# EAGLE design untitled (EAGLE 9.6.2)
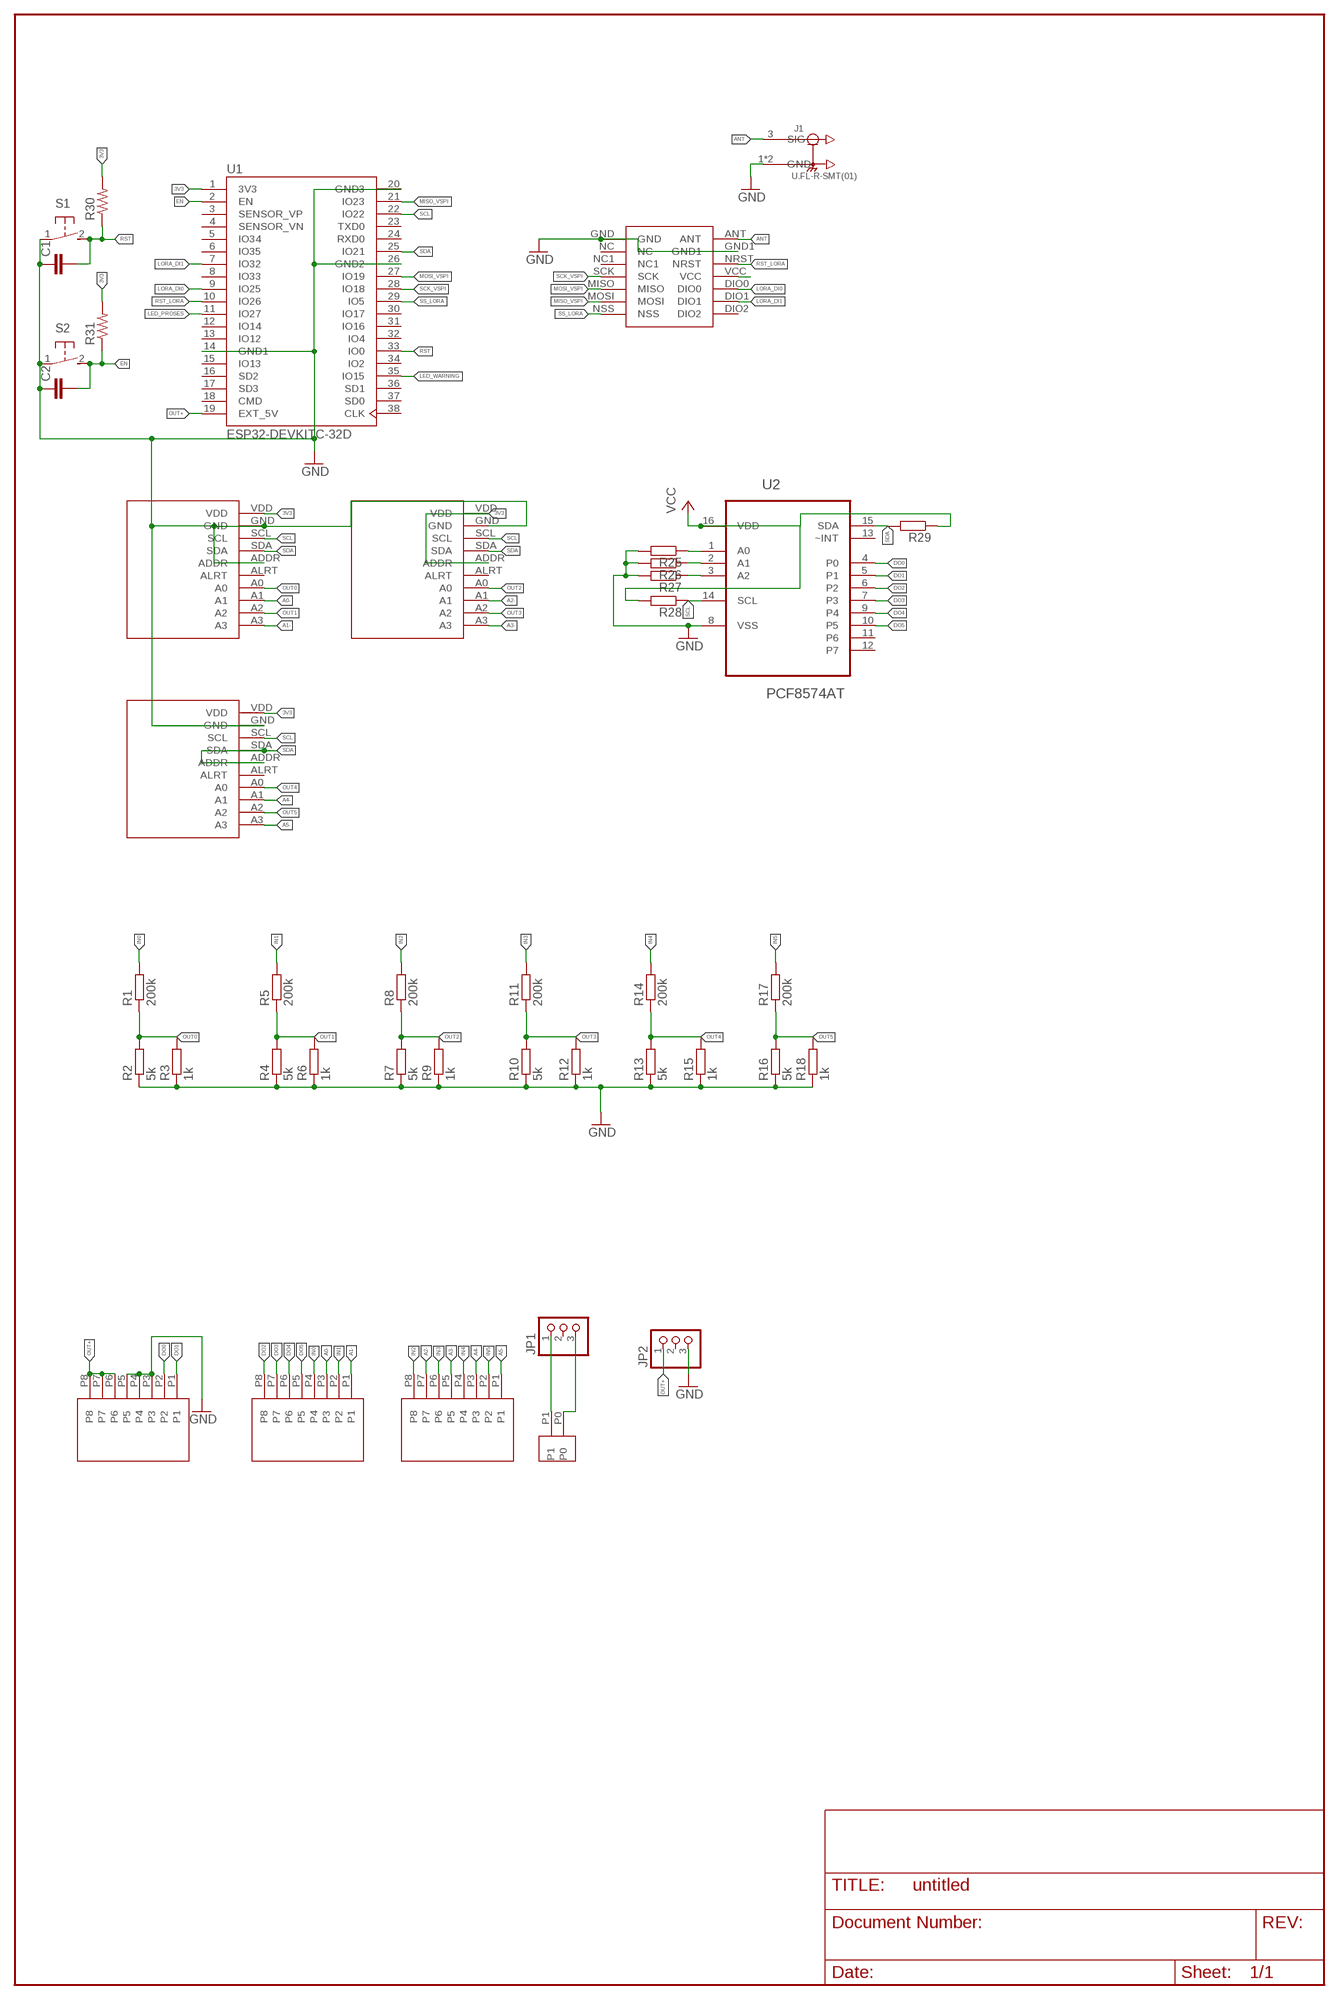
[diagram p0: schematic, sheet 1]

## Parts
ADS1  ADS1115  [ADS1115]
ADS2  ADS1115  [ADS1115]
ADS3  ADS1115  [ADS1115]
C1  C-EUC0805K  [C0805K]
C2  C-EUC0805K  [C0805K]
CONN2P-3.5PI1  CONN2P-3.5PI  [CONN2P-3.5PI]
CONN3.1  CONN3.5  [CONN3.5]
CONN3.2  CONN3.5  [CONN3.5]
CONN3.3  CONN3.5  [CONN3.5]
J1  U.FL-R-SMT(01)  [HRS_U.FL-R-SMT(01)]
JP1  PINHD-1X3  [1X03]
JP2  PINHD-1X3  [1X03]
LORA-NICERF-V1  LORA-NICERF-V2  [LORA-NICERF-V2]
R1  200k  R-EU_R0805  [R0805]
R2  5k  R-EU_R0805  [R0805]
R3  1k  R-EU_R0805  [R0805]
R4  5k  R-EU_R0805  [R0805]
R5  200k  R-EU_R0805  [R0805]
R6  1k  R-EU_R0805  [R0805]
R7  5k  R-EU_R0805  [R0805]
R8  200k  R-EU_R0805  [R0805]
R9  1k  R-EU_R0805  [R0805]
R10  5k  R-EU_R0805  [R0805]
R11  200k  R-EU_R0805  [R0805]
R12  1k  R-EU_R0805  [R0805]
R13  5k  R-EU_R0805  [R0805]
R14  200k  R-EU_R0805  [R0805]
R15  1k  R-EU_R0805  [R0805]
R16  5k  R-EU_R0805  [R0805]
R17  200k  R-EU_R0805  [R0805]
R18  1k  R-EU_R0805  [R0805]
R25  R-EU_R0805  [R0805]
R26  R-EU_R0805  [R0805]
R27  R-EU_R0805  [R0805]
R28  R-EU_R0805  [R0805]
R29  R-EU_R0805  [R0805]
R30  R-US_M0805  [M0805]
R31  R-US_M0805  [M0805]
S1  31-XX  [B3F-31XX]
S2  31-XX  [B3F-31XX]
U1  ESP32-DEVKITC-32D  [MODULE_ESP32-DEVKITC-32D]
U2  PCF8574AT  [SOIC127P1032X265-16N]

## Nets
3V3: ADS1.VDD ADS2.ADDR ADS2.VDD ADS3.VDD R30.2 R31.2 U1.1(3V3)
A0-: ADS1.A1 CONN3.2.P3
A1-: ADS1.A3 CONN3.2.P1
A2-: ADS2.A1 CONN3.3.P7
A3-: ADS2.A3 CONN3.3.P5
A4-: ADS3.A1 CONN3.3.P3
A5-: ADS3.A3 CONN3.3.P1
ANT: J1.3(SIG) LORA-NICERF-V1.ANT
DO0: CONN3.1.P2 U2.4(P0)
DO1: CONN3.1.P1 U2.5(P1)
DO2: CONN3.2.P8 U2.6(P2)
DO3: CONN3.2.P7 U2.7(P3)
DO4: CONN3.2.P6 U2.9(P4)
DO5: CONN3.2.P5 U2.10(P5)
EN: C2.2 R31.1 S2.2(S) U1.2(EN)
GND: ADS1.ADDR ADS1.GND ADS2.GND ADS3.GND C1.1 C2.1 CONN3.1.P3 CONN3.1.P4 CONN3.1.P5 J1.1(GND) J1.2(GND) JP2.3 LORA-NICERF-V1.GND LORA-NICERF-V1.GND1 R2.1 R3.1 R4.1 R6.1 R7.1 R9.1 R10.1 R12.1 R13.1 R15.1 R16.1 R18.1 R25.2 R26.2 R27.2 S1.1(P) S2.1(P) U1.14(GND1) U1.20(GND3) U1.26(GND2) U2.8(VSS)
IN0: CONN3.2.P4 R1.2
IN1: CONN3.2.P2 R5.2
IN2: CONN3.3.P8 R8.2
IN3: CONN3.3.P6 R11.2
IN4: CONN3.3.P4 R14.2
IN5: CONN3.3.P2 R17.2
LED_PROSES: U1.11(IO27)
LED_WARNING: U1.35(IO15)
LORA_DI0: LORA-NICERF-V1.DIO0 U1.9(IO25)
LORA_DI1: LORA-NICERF-V1.DIO1 U1.7(IO32)
MISO_VSPI: LORA-NICERF-V1.MOSI U1.21(IO23)
MOSI_VSPI: LORA-NICERF-V1.MISO U1.27(IO19)
N$1: R25.1 U2.1(A0)
N$2: R26.1 U2.2(A1)
N$3: R27.1 U2.3(A2)
N$4: CONN2P-3.5PI1.P1 JP1.1
N$5: CONN2P-3.5PI1.P0 JP1.3
N$26: LORA-NICERF-V1.VCC
OUT0: ADS1.A0 R1.1 R2.2 R3.2
OUT1: ADS1.A2 R4.2 R5.1 R6.2
OUT2: ADS2.A0 R7.2 R8.1 R9.2
OUT3: ADS2.A2 R10.2 R11.1 R12.2
OUT4: ADS3.A0 R13.2 R14.1 R15.2
OUT5: ADS3.A2 R16.2 R17.1 R18.2
OUT+: CONN3.1.P6 CONN3.1.P7 CONN3.1.P8 JP2.1 U1.19(EXT_5V)
RST: C1.2 R30.1 S1.2(S) U1.33(IO0)
RST_LORA: LORA-NICERF-V1.NRST U1.10(IO26)
SCK_VSPI: LORA-NICERF-V1.SCK U1.28(IO18)
SCL: ADS1.SCL ADS2.SCL ADS3.SCL R28.1 U1.22(IO22) U2.14(SCL)
SDA: ADS1.SDA ADS2.SDA ADS3.ADDR ADS3.SDA R29.2 U1.25(IO21) U2.15(SDA)
SS_LORA: LORA-NICERF-V1.NSS U1.29(IO5)
VCC: R28.2 R29.1 U2.16(VDD)
Unconnected: ADS1.ALRT ADS2.ALRT ADS3.ALRT JP1.2 JP2.2 LORA-NICERF-V1.DIO2 LORA-NICERF-V1.NC LORA-NICERF-V1.NC1 U1.3(SENSOR_VP) U1.4(SENSOR_VN) U1.5(IO34) U1.6(IO35) U1.8(IO33) U1.12(IO14) U1.13(IO12) U1.15(IO13) U1.16(SD2) U1.17(SD3) U1.18(CMD) U1.23(TXD0) U1.24(RXD0) U1.30(IO17) U1.31(IO16) U1.32(IO4) U1.34(IO2) U1.36(SD1) U1.37(SD0) U1.38(CLK) U2.11(P6) U2.12(P7) U2.13(~INT)

## Library data of the parts
ADS1-ADS3 = ds1115:ADS1115
C1 C2 = rcl:C-EU: CAPACITOR, European symbol; SPICEPREFIX: C
CONN2P-3.5PI1 = CONN2P-3.5PI:CONN2P-3.5PI
CONN3.1-CONN3.3 = CONN3.5:CONN3.5
J1 = U.FL-R-SMT_01_:U.FL-R-SMT(01): U.FL Series 6 Ghz 50 Ohm Ultra-small SMT Coaxial Cable Receptacle Check availability <https://pricing.snapeda.com/parts/U.FL-R-SMT%2801%29/Hirose/view-part?ref=eda>; AVAILABILITY: In Stock; DESCRIPTION: U.FL (UMCC) Connector Receptacle, Male Pin 50Ohm Surface Mount Solder. RF Connectors / Coaxial Connectors; MF: Hirose; MP: U.FL-R-SMT(01); PACKAGE: None; PRICE: None; PURCHASE-URL: https://pricing.snapeda.com/search/part/U.FL-R-SMT(01)/?ref=eda
JP1 JP2 = pinhead:PINHD-1X3: PIN HEADER
LORA-NICERF-V1 = LORA-NICERF-V2:LORA-NICERF-V2
R1-R18 R25-R29 = rcl:R-EU_: RESISTOR, European symbol; SPICEPREFIX: R
R30 R31 = adafruit:R-US_: RESISTOR, American symbol
S1 S2 = switch-omron:31-XX: OMRON SWITCH; MPN: B3F-3100; OC_FARNELL: 959704; OC_NEWARK: 36M3582
U1 = ESP32-DEVKITC-32D:ESP32-DEVKITC-32D: Eval Board For Esp-Wroom-32 Check availability <https://pricing.snapeda.com/parts/ESP32-DEVKITC-32D/Espressif%20Systems/view-part?ref=eda>; AVAILABILITY: In Stock; DESCRIPTION: WiFi Development Tools (802.11) ESP32 General Development Kit, ESP32-WROOM-32D on the board; MF: Espressif Systems; MP: ESP32-DEVKITC-32D; PACKAGE: None; PRICE: None; PURCHASE-URL: https://pricing.snapeda.com/search/part/ESP32-DEVKITC-32D/?ref=eda
U2 = PCF8574AT:PCF8574AT: Remote 8-bit I/O expander for I2C-bus Check availability <https://pricing.snapeda.com/parts/PCF8574AT/NXP%20USA/view-part?ref=eda>; AVAILABILITY: In Stock; DESCRIPTION: I²C Bus IC Operating temperature: -40...+85 °C Power supply: 2.5...6 V Package: SO-16W; MF: NXP USA; MP: PCF8574AT; PACKAGE: SOIC-16 NXP USA; PRICE: None; PURCHASE-URL: https://pricing.snapeda.com/search/part/PCF8574AT/?ref=eda

## Board
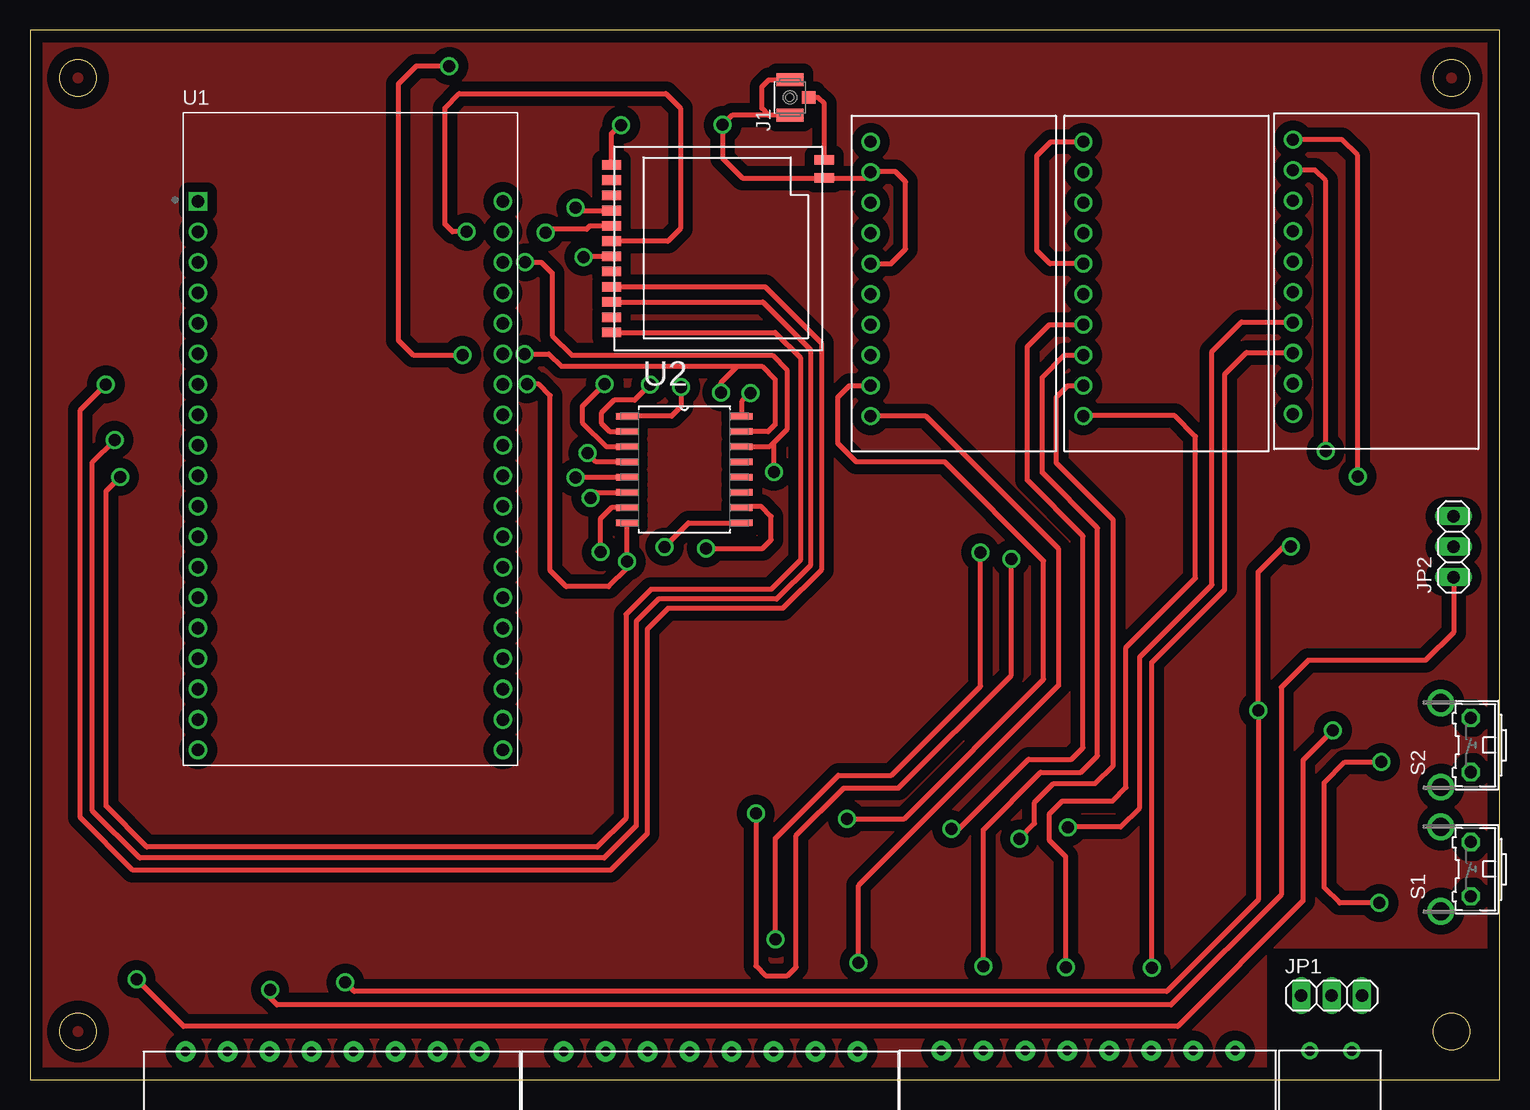
[diagram p1: board, top side]
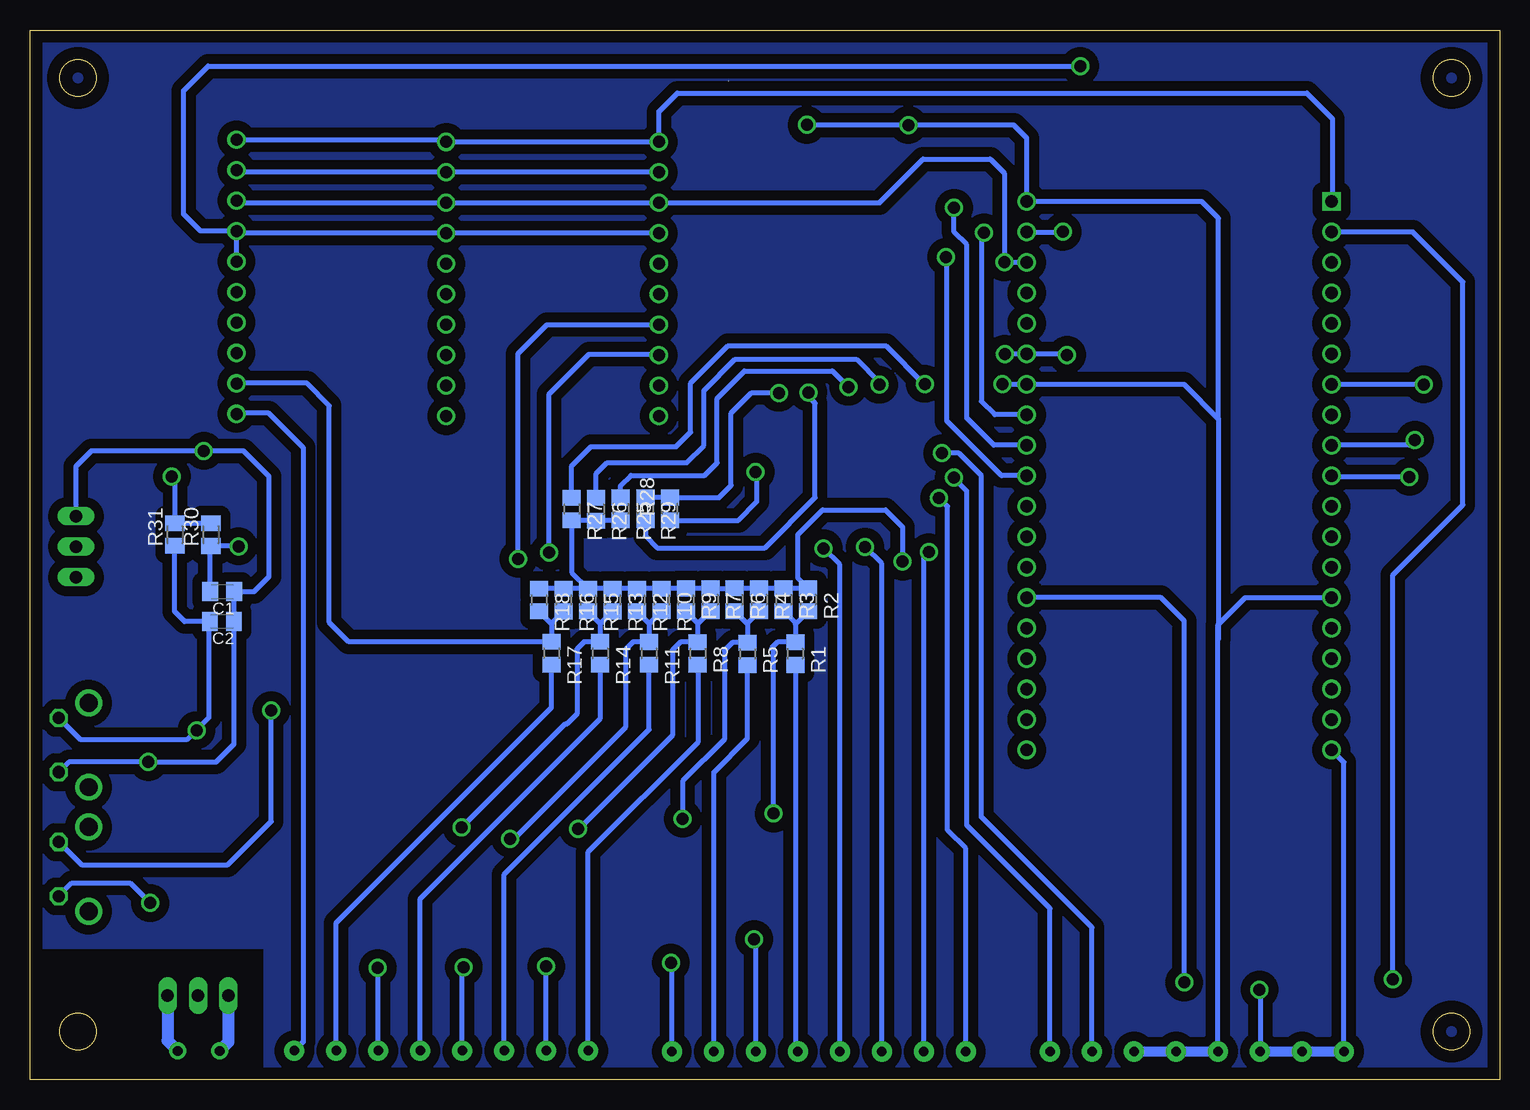
[diagram p2: board, bottom side, seen from below]

Size 122.5 x 87.5 mm. Coordinates in mm from the lower left corner, seen from the top.
Outline: 0,0 122.5,0 122.5,87.5 0,87.5 0,0
Outline: circle at 118.5,83.5 radius 1.5
Outline: circle at 118.5,4 radius 1.5
Outline: circle at 4,4 radius 1.5
Outline: circle at 4,83.5 radius 1.5
Copper layers (1*16): Top 0.035mm / dielectric 1.5mm / Bottom 0.035mm
Design rules "default": minimum track width 6mil, minimum drill 0.35mm, track to track 6mil, track to pad 6mil, pad to pad 6mil, via to via 6mil, smd to smd 6mil, copper to edge 40mil, drill to drill 6mil, minimum pad ring 10mil, minimum via ring 8mil, stop-mask expansion 4mil, vias tented up to drill 0mil, thermal gap 10mil

### Footprints (pad centres in the part's own frame; a part is rotated, then mirrored left to right if it is on the bottom)
ADS1115 = drill 1: A0 -6.35,-1.27; A1 -6.35,-3.81; A2 -6.35,-6.35; A3 -6.35,-8.89; ADDR -6.35,3.81; ALRT -6.35,1.27; GND -6.35,11.43; SCL -6.35,8.89; SDA -6.35,6.35; VDD -6.35,13.97
C0805K = smd 1.3 x 1.6: 1 -1,0; 2 1,0
CONN2P-3.5PI = drill 0.8 pad 1.422: P0 2.421,0.016; P1 5.921,0.016
CONN3.5 = drill 0.8 pad 1.676: P1 -28,0; P2 -24.5,0; P3 -21,0; P4 -17.5,0; P5 -14,0; P6 -10.5,0; P7 -7,0; P8 -3.5,0
HRS_U.FL-R-SMT(01) = smd 1.1 x 2.25: 1 -1.475,0; 2 1.475,0 | smd 1.05 x 1.1: 3 0,-1.55
1X03 = drill 1.016 long: 1 -2.54,0; 2 0,0; 3 2.54,0
LORA-NICERF-V2 = smd 1.6 x 0.8: ANT 9.17,6.81; DIO0 -8.57,-5.03; DIO1 -8.57,-3.76; DIO2 -8.57,-2.49; GND -8.57,6.4; GND1 9.17,5.31; MISO -8.57,1.32; MOSI -8.57,0.05; NC -8.57,5.13; NC1 -8.57,3.86; NRST -8.57,-7.57; NSS -8.57,-1.22; SCK -8.57,2.59; VCC -8.57,-6.3
R0805 = smd 1.3 x 1.5: 1 -0.95,0; 2 0.95,0
M0805 = smd 1.3 x 1.6: 1 -0.95,0; 2 0.95,0
B3F-31XX = drill 1.016 octagon: 1 -2.261,-1.245; 2 2.261,-1.245 | drill 1.499 pad 2.159: 3 -3.505,1.245; 4 3.505,1.245
MODULE_ESP32-DEVKITC-32D = drill 1.04 square: 1 -12.7,19.76 | drill 1.04: 2 -12.7,17.22; 3 -12.7,14.68; 4 -12.7,12.14; 5 -12.7,9.6; 6 -12.7,7.06; 7 -12.7,4.52; 8 -12.7,1.98; 9 -12.7,-0.56; 10 -12.7,-3.1; 11 -12.7,-5.64; 12 -12.7,-8.18; 13 -12.7,-10.72; 14 -12.7,-13.26; 15 -12.7,-15.8; 16 -12.7,-18.34; 17 -12.7,-20.88; 18 -12.7,-23.42; 19 -12.7,-25.96; 20 12.7,19.76; 21 12.7,17.22; 22 12.7,14.68; 23 12.7,12.14; 24 12.7,9.6; 25 12.7,7.06; 26 12.7,4.52; 27 12.7,1.98; 28 12.7,-0.56; 29 12.7,-3.1; 30 12.7,-5.64; 31 12.7,-8.18; 32 12.7,-10.72; 33 12.7,-13.26; 34 12.7,-15.8; 35 12.7,-18.34; 36 12.7,-20.88; 37 12.7,-23.42; 38 12.7,-25.96
SOIC127P1032X265-16N = smd 1.803 x 0.533: 1 -4.775,4.445; 2 -4.775,3.175; 3 -4.775,1.905; 4 -4.775,0.635; 5 -4.775,-0.635; 6 -4.775,-1.905; 7 -4.775,-3.175; 8 -4.775,-4.445; 9 4.775,-4.445; 10 4.775,-3.175; 11 4.775,-1.905; 12 4.775,-0.635; 13 4.775,0.635; 14 4.775,1.905; 15 4.775,3.175; 16 4.775,4.445

### Placement (x,y rotation side)
ADS1  76.43,64.2 0 top
ADS2  94.15,64.2 0 top
ADS3  111.64,64.39 0 top
C1  106.48,40.68 180 bottom
C2  106.5,38.19 180 bottom
CONN2P-3.5PI1  112.61,2.4 180 top
CONN3.1  9.47,2.33 180 top
CONN3.2  40.99,2.33 180 top
CONN3.3  72.47,2.4 180 top
J1  63.36,81.87 90 top
JP1  108.5,7 0 top
JP2  118.67,44.42 90 top
LORA-NICERF-V1  57.04,69.85 0 top
R1  58.7,35.51 270 bottom
R2  57.63,40 270 bottom
R3  59.67,40 270 bottom
R4  61.71,40 270 bottom
R5  62.69,35.48 270 bottom
R6  63.75,40 270 bottom
R7  65.79,39.99 270 bottom
R8  66.84,35.52 270 bottom
R9  67.82,39.99 270 bottom
R10  69.86,39.98 270 bottom
R11  70.89,35.53 270 bottom
R12  71.89,39.98 270 bottom
R13  73.94,39.97 270 bottom
R14  74.97,35.54 270 bottom
R15  75.98,39.98 270 bottom
R16  78.01,39.97 270 bottom
R17  79.03,35.55 270 bottom
R18  80.06,39.98 270 bottom
R25  73.25,47.57 270 bottom
R26  75.3,47.55 270 bottom
R27  77.34,47.56 270 bottom
R28  69.16,47.57 90 bottom
R29  71.21,47.58 270 bottom
R30  107.41,45.43 90 bottom
R31  110.41,45.43 90 bottom
S1  118.86,17.54 90 top
S2  118.86,27.88 90 top
U1  26.71,53.44 0 top
U2  54.55,50.85 0 top

### Tracks (layer width: path | path; a pad name or v marks a point on that pad's centre or on a via)
3V3  (via drill 1)
  Top 0.406: ADS2.ADDR 85.04,68.01 83.93,69.12 83.93,77.02 85.09,78.18 ADS2.VDD | v110.68,50.28 110.68,77.04 109.35,78.37 105.3,78.37 ADS3.VDD
  Bottom 0.406: ADS3.VDD 87.99,78.36 ADS2.VDD ADS1.VDD 70.08,80.69 68.54,82.23 16.06,82.23 13.93,80.1 13.93,73.28 U1.1 | R30.2 R31.2 110.41,50.01 v110.68,50.28
A0-  (via drill 1)
  Top 0.406: v62.14,11.69 62.14,20.11 67.38,25.36 71.8,25.36 79.23,32.78 79.23,43.92 v79.21,43.94
  Bottom 0.406: CONN3.2.P3 61.99,11.5 62.16,11.67 v62.14,11.69 | v79.21,43.94 79.21,57.16 75.9,60.47 70.16,60.47 ADS1.A1
A1-  (via drill 1)
  Top 0.406: v69.07,9.73 69.07,16.18 85.77,32.88 85.77,44.22 74.68,55.31 ADS1.A3
  Bottom 0.406: CONN3.2.P1 68.99,9.65 v69.07,9.73
A2-  (via drill 1)
  Top 0.406: v79.46,9.43 79.46,20.83 84.24,25.61 87.61,25.61 88.99,26.98 88.99,45.98 84.38,50.59 84.38,58.54 86.23,60.39 ADS2.A1
  Bottom 0.406: CONN3.3.P7 v79.47,9.42 v79.46,9.43
A3-  (via drill 1)
  Top 0.406: v86.35,9.36 86.35,18.57 84.98,19.93 84.98,22.15 86.05,23.22 90.27,23.22 91.37,24.33 91.37,36.03 97.15,41.8 97.15,53.61 95.42,55.34 87.83,55.34 ADS2.A3
  Bottom 0.406: CONN3.3.P5 86.47,9.23 v86.35,9.36
A4-  (via drill 1)
  Top 0.406: v93.52,9.31 93.52,34.77 99.6,40.85 99.6,58.8 101.42,60.61 105.26,60.61 ADS3.A1
  Bottom 0.406: CONN3.3.P3 93.47,9.26 v93.52,9.31
A5-
  Bottom 0.406: CONN3.3.P1 99.72,3.15 99.72,52.68 102.6,55.56 105.23,55.56 ADS3.A3
ANT
  Top 0.406: LORA-NICERF-V1.ANT 66.21,81.37 65.71,81.87 J1.3
DO0  (via drill 1)
  Top 0.406: U2.4 47.2,51.48 v46.48,52.21
  Bottom 0.406: CONN3.1.P2 33.97,12.68 43.19,21.9 43.19,50.34 45.06,52.21 v46.48,52.21
DO1  (via drill 1)
  Top 0.406: v45.5,50.17 45.54,50.22 U2.5
  Bottom 0.406: CONN3.1.P1 37.47,14.27 44.41,21.21 44.41,49.08 v45.5,50.17
DO2  (via drill 1)
  Top 0.406: v46.72,48.5 47.16,48.95 U2.6
  Bottom 0.406: CONN3.2.P8 44.49,19.27 46,20.78 46,47.78 v46.72,48.5
DO3  (via drill 1)
  Top 0.406: v47.56,43.98 47.56,46.78 48.2,47.41 48.38,47.6 48.46,47.67 U2.7
  Bottom 0.406: CONN3.2.P7 47.99,43.55 v47.56,43.98
DO4  (via drill 1)
  Top 0.406: v52.9,44.41 54.89,46.41 U2.9
  Bottom 0.406: CONN3.2.P6 51.49,43.01 v52.9,44.41
DO5  (via drill 1)
  Top 0.406: v56.34,44.28 61.08,44.28 61.79,44.98 61.79,46.96 60.99,47.76 59.41,47.76 U2.10
  Bottom 0.406: CONN3.2.P5 54.99,42.93 v56.34,44.28 | v56.34,44.28
EN  (via drill 1)
  Top 0.406: v108.62,29.12 106.12,26.62 106.12,14.88 95.67,4.43 12.81,4.43 v8.88,8.36
  Bottom 0.406: C2.2 107.67,38.19 | 107.67,38.19 109.61,38.19 110.45,39.02 110.45,44.44 R31.1 | S2.2 118.33,28.37 109.38,28.37 v108.62,29.12 107.56,30.18 107.56,38.08 107.67,38.19 | v8.88,8.36 8.88,42.08 3.05,47.91 3.05,66.49 7.21,70.66 U1.2
GND  (via drill 1)
  Top 0.406: J1.1 61.57,80.39 | 61.57,80.39 61.01,80.96 61.01,82.76 61.59,83.34 J1.2 | LORA-NICERF-V1.GND 48.47,78.86 49.23,79.62 | 49.23,79.62 | 49.23,79.62 v49.27,79.57 | 61.57,80.39 58.54,80.39 v57.74,79.59 57.74,76.82 59.39,75.16 LORA-NICERF-V1.GND1 69.61,75.16 ADS1.GND 70.15,75.7 72.14,75.7 73,74.84 73,69.23 71.78,68.01 ADS1.ADDR | v112.48,14.71 109.17,14.71 107.89,15.99 107.89,24.75 109.61,26.47 v112.63,26.47 | U2.8 49.75,46.38 v49.75,43.17 49.75,42.6 48.24,41.09 44.69,41.09 43.36,42.42 43.36,57.04 42.42,57.98 v41.42,57.98 | v108.01,52.41 108.01,74.93 107.11,75.82 ADS3.GND
  Bottom 0.406: CONN3.1.P5 23.47,36.7 | 23.47,36.7 23.47,37.9 21.19,40.18 U1.14 | 23.43,55.08 26.3,57.96 U1.26 39.43,57.98 v41.42,57.98 | 23.43,55.08 23.43,36.75 23.47,36.7 | 23.43,55.08 23.43,71.81 24.82,73.2 U1.20 39.41,78.5 40.48,79.57 v49.27,79.57 57.72,79.57 v57.74,79.59 | R6.1 R4.1 61.7,40.95 R3.1 R2.1 58.5,41.82 58.5,45.42 56.42,47.49 51.19,47.49 49.75,46.06 v49.75,43.17 | R6.1 | R6.1 R7.1 R9.1 69.85,40.94 R10.1 R12.1 | R12.1 | R12.1 R13.1 R15.1 | R15.1 R16.1 R18.1 | ADS1.GND ADS2.GND 105.1,75.63 ADS3.GND | JP2.3 118.67,51.12 117.39,52.41 v108.01,52.41 104.69,52.41 102.57,50.28 102.57,41.93 103.83,40.68 C1.1 105.5,40.66 C2.1 105.49,27.96 106.98,26.47 v112.63,26.47 119.25,26.47 S2.1 | S1.1 119,16.38 114.15,16.38 v112.48,14.71 | R25.2 75.27,46.62 R26.2 77.33,46.6 R27.2 77.34,42.28 R15.1
  Bottom 0.813: CONN3.1.P5 CONN3.1.P4 CONN3.1.P3
IN0
  Bottom 0.406: R1.2 58.7,2.54 CONN3.2.P4
IN1
  Bottom 0.406: CONN3.2.P2 65.49,25.62 62.69,28.42 R5.2
IN2
  Bottom 0.406: CONN3.3.P8 75.97,18.98 66.78,28.16 66.78,33.92 66.86,34 66.86,34.55 R8.2
IN3
  Bottom 0.406: CONN3.3.P6 82.97,17.1 70.89,29.18 R11.2
IN4
  Bottom 0.406: CONN3.3.P4 89.97,15.08 74.94,30.11 74.94,34.56 R14.2
IN5
  Bottom 0.406: CONN3.3.P2 96.97,13.06 86.5,23.53 79.03,31.01 R17.2
LORA_DI0  (via drill 1)
  Top 0.406: LORA-NICERF-V1.DIO0 61.09,64.82 65.04,60.87 65.04,42.85 62.24,40.05 52.39,40.05 50.54,38.2 50.54,21.13 47.87,18.46 9.15,18.46 5.2,22.41 5.2,51.47 v7.06,53.33
  Bottom 0.406: v7.06,53.33 7.51,52.88 U1.9
LORA_DI1  (via drill 1)
  Top 0.406: LORA-NICERF-V1.DIO1 61.29,66.09 65.97,61.41 65.97,42.5 62.75,39.28 53.19,39.28 51.44,37.53 51.44,20.49 48.41,17.46 8.57,17.46 4.19,21.84 4.19,55.81 v6.33,57.95
  Bottom 0.406: v6.33,57.95 U1.7
MISO_VSPI  (via drill 1)
  Top 0.406: v36.41,70.67 35.22,70.67 34.59,71.3 34.59,80.99 35.78,82.19 53,82.19 54.22,80.97 54.22,70.94 53.17,69.89 LORA-NICERF-V1.MOSI
  Bottom 0.406: U1.21 36.45,70.66 36.43,70.68 v36.41,70.67
MOSI_VSPI  (via drill 1)
  Top 0.406: v42.97,70.62 43.24,70.89 46.41,70.89 46.69,71.17 LORA-NICERF-V1.MISO
  Bottom 0.406: U1.27 42.07,55.42 43.19,56.54 43.19,70.4 v42.97,70.62
N$1  (via drill 1)
  Top 0.406: v54.29,57.74 54.29,56.09 53.49,55.3 U2.1
  Bottom 0.406: R25.1 73.25,49.53 72.41,50.37 66.25,50.37 65.22,51.4 65.22,56.79 62.94,59.07 55.62,59.07 v54.29,57.74
N$2  (via drill 1)
  Top 0.406: v51.7,57.92 50.41,56.63 48.69,56.63 47.62,55.56 47.62,54.73 48.33,54.02 U2.2
  Bottom 0.406: R26.1 75.3,50.51 74.39,51.42 67.77,51.42 66.33,52.86 66.33,57.43 63.71,60.05 53.62,60.05 51.7,58.12 v51.7,57.92
N$3  (via drill 1)
  Top 0.406: v47.91,57.99 46.04,56.12 46.04,54.78 48.07,52.76 U2.3
  Bottom 0.406: R27.1 77.34,51.16 75.75,52.76 68.64,52.76 67.43,53.97 67.43,58.05 64.3,61.18 51.16,61.18 47.98,57.99 v47.91,57.99
N$4
  Bottom 1.016: JP1.1 105.96,3.11 CONN2P-3.5PI1.P1
N$5
  Bottom 1.016: JP1.3 111.04,3.23 CONN2P-3.5PI1.P0
N$6
  pour Top (isolate 0.813): 0,87.5 122.5,87.5 122.5,11 103,11 103,0 0,0
N$7
  pour Bottom (isolate 0.813): 0,87.5 122.5,87.5 122.5,11 103,11 103,0 0,0
OUT0  (via drill 1)
  Top 0.406: v60.5,22.18 60.5,9.47 61.32,8.65 63.14,8.65 63.86,9.37 63.86,20.33 67.84,24.31 72.41,24.31 81.8,33.7 v81.8,43.41
  Bottom 0.406: R2.2 58.7,37.98 R1.1 | R3.2 58.7,38.09 R1.1 | R1.1 60.17,36.46 60.67,35.96 60.58,35.87 60.58,22.26 v60.5,22.18 | v81.8,43.41 81.8,60.53 79.4,62.93 ADS1.A0
OUT1  (via drill 1)
  Top 0.406: v68.09,21.75 72.89,21.75 84.5,33.36 84.5,43.24 76.26,51.48 68.89,51.48 67.34,53.03 67.34,56.89 68.3,57.85 ADS1.A2
  Bottom 0.406: R4.2 62.69,38.06 R5.1 | R6.2 62.69,37.99 R5.1 | R5.1 63.94,36.43 64.61,35.76 64.61,28.36 68.09,24.89 v68.09,21.75
OUT2  (via drill 1)
  Top 0.406: v76.81,20.89 77.44,20.89 83.24,26.7 86.83,26.7 87.79,27.66 87.79,45.3 83.13,49.96 83.13,61.1 84.97,62.93 ADS2.A0
  Bottom 0.406: R7.2 66.84,37.99 R8.1 | R9.2 66.84,38.05 R8.1 | R8.1 68.28,36.47 68.94,35.81 68.94,28.69 76.74,20.89 v76.81,20.89
OUT3  (via drill 1)
  Top 0.406: v82.46,20.07 83.74,21.35 83.74,23.09 85.32,24.67 88.79,24.67 90.3,26.19 90.3,46.66 85.56,51.41 85.56,56.89 86.52,57.85 ADS2.A2
  Bottom 0.406: R10.2 70.89,38 R11.1 | R12.2 70.89,38.02 R11.1 | R11.1 72.21,36.48 72.86,35.84 72.86,29.36 82.15,20.07 v82.46,20.07
OUT4  (via drill 1)
  Top 0.406: v86.5,21.02 86.54,21.06 90.91,21.06 92.51,22.66 92.51,35.21 98.54,41.24 98.54,60.69 101,63.15 105.26,63.15 ADS3.A0
  Bottom 0.406: R13.2 74.97,38 R14.1 | R15.2 74.97,38.01 R14.1 | R14.1 76.32,36.49 76.91,35.9 76.91,30.47 77.74,29.64 77.88,29.64 v86.5,21.02
OUT5
  Bottom 0.406: R16.2 79.03,38.01 R17.1 | R18.2 79.03,37.99 R17.1 | R17.1 95.93,36.5 97.55,38.12 97.55,56.18 99.41,58.05 ADS3.A2
OUT+  (via drill 1)
  Top 0.406: JP2.1 118.67,37.29 116.33,34.95 106.55,34.95 104.3,32.69 104.3,15.4 95.12,6.22 20.59,6.22 20,6.81 v20,7.48
  Bottom 0.406: CONN3.1.P8 12.97,26.44 U1.19 | v20,7.48 19.95,7.43 19.95,2.35 CONN3.1.P6
  Bottom 0.813: CONN3.1.P8 CONN3.1.P7 CONN3.1.P6
RST  (via drill 1)
  Top 0.406: v105.11,44.45 105.11,44.48 105.09,44.5 104.55,44.5 102.38,42.33 v102.38,30.79 102.38,14.96 94.77,7.35 27.03,7.35 v26.28,8.1
  Bottom 0.406: C1.2 107.48,44.41 R30.1 105.14,44.48 v105.11,44.45 | S1.2 118.2,17.9 106,17.9 102.38,21.52 v102.38,30.79 | v26.28,8.1 26.28,38.24 28.22,40.18 U1.33
RST_LORA  (via drill 1)
  Top 0.406: LORA-NICERF-V1.NRST 62.12,62.28 64.22,60.18 64.22,43.29 61.79,40.86 51.75,40.86 49.67,38.78 49.67,21.79 47.28,19.39 9.74,19.39 6.34,22.8 6.34,49.06 v7.51,50.23
  Bottom 0.406: v7.51,50.23 13.9,50.23 U1.10
SCK_VSPI  (via drill 1)
  Top 0.406: v45.46,72.68 45.71,72.44 LORA-NICERF-V1.SCK
  Bottom 0.406: U1.28 42.16,52.88 44.41,55.13 44.41,69.59 45.46,70.65 v45.46,72.68
SCL  (via drill 1)
  Top 0.406: v41.28,68.14 42.62,68.14 43.52,67.23 43.52,62.02 45.17,60.38 61.88,60.38 63.09,59.16 63.09,54.2 62.01,53.12 | 62.01,53.12 61.64,52.75 U2.14 | v62.01,50.65 62.01,53.12
  Bottom 0.406: U1.22 40.98,68.12 40.99,68.14 v41.28,68.14 41.28,75.56 42.45,76.73 48.04,76.73 51.68,73.09 ADS1.SCL ADS2.SCL 105.1,73.09 ADS3.SCL | R28.1 63.45,46.62 61.9,48.17 61.9,50.65 v62.01,50.65
SDA  (via drill 1)
  Top 0.406: v41.24,60.49 43.27,60.49 44.3,59.46 58.98,59.46 | 58.98,59.46 61.01,59.46 62.1,58.37 62.1,54.6 61.52,54.02 U2.15 | v34.96,84.5 32.21,84.5 30.7,82.99 30.7,61.64 31.94,60.4 v36.05,60.4 v36.06,60.4 | v57.61,57.29 57.61,58.09 58.98,59.46
  Bottom 0.406: v41.24,60.49 41.22,60.51 41.22,60.5 U1.25 36.16,60.5 v36.06,60.4 | ADS1.SDA ADS2.SDA 105.1,70.55 | 105.1,70.55 ADS3.SDA 108.29,70.74 109.71,72.16 109.71,82.46 107.67,84.5 v34.96,84.5 | ADS3.ADDR 105.29,70.36 105.1,70.55 | R29.2 71.21,45.3 70.22,44.32 61.24,44.32 57.05,48.51 57.05,56.39 57.61,56.95 v57.61,57.29
SS_LORA  (via drill 1)
  Top 0.406: v46.13,68.57 46.18,68.63 LORA-NICERF-V1.NSS
  Bottom 0.406: U1.29 41.52,50.34 46.08,54.9 46.08,68.52 v46.13,68.57
VCC  (via drill 1)
  Top 0.406: v60.06,57.25 59.33,56.51 U2.16
  Bottom 0.406: R29.1 71.2,48.52 R28.2 65.05,48.52 64.04,49.52 64.04,55.56 62.34,57.26 60.06,57.26 v60.06,57.25